# Altium schematic sheet Zigbee.SchDoc
size A4
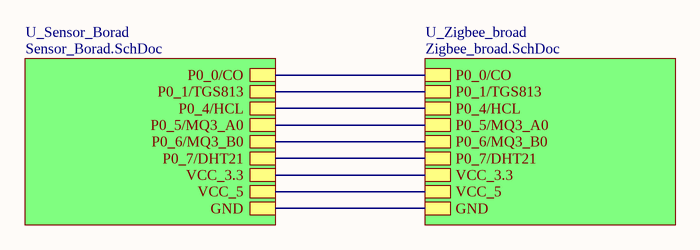
[diagram p0: Zigbee.SchDoc]

## Sub-sheets
U_Sensor_Borad = Sensor_Borad.SchDoc: P0_0/CO, P0_1/TGS813, P0_4/HCL, P0_5/MQ3_A0, P0_6/MQ3_B0, P0_7/DHT21, VCC_3.3, VCC_5, GND
U_Zigbee_broad = Zigbee_broad.SchDoc: P0_0/CO, P0_1/TGS813, P0_4/HCL, P0_5/MQ3_A0, P0_6/MQ3_B0, P0_7/DHT21, VCC_3.3, VCC_5, GND

## Nets
(unnamed): sheet U_Sensor_Borad/P0_0/CO, sheet U_Zigbee_broad/P0_0/CO
(unnamed): sheet U_Sensor_Borad/P0_1/TGS813, sheet U_Zigbee_broad/P0_1/TGS813
(unnamed): sheet U_Sensor_Borad/P0_4/HCL, sheet U_Zigbee_broad/P0_4/HCL
(unnamed): sheet U_Sensor_Borad/P0_5/MQ3_A0, sheet U_Zigbee_broad/P0_5/MQ3_A0
(unnamed): sheet U_Sensor_Borad/P0_6/MQ3_B0, sheet U_Zigbee_broad/P0_6/MQ3_B0
(unnamed): sheet U_Sensor_Borad/P0_7/DHT21, sheet U_Zigbee_broad/P0_7/DHT21
(unnamed): sheet U_Sensor_Borad/VCC_3.3, sheet U_Zigbee_broad/VCC_3.3
(unnamed): sheet U_Sensor_Borad/VCC_5, sheet U_Zigbee_broad/VCC_5
(unnamed): sheet U_Sensor_Borad/GND, sheet U_Zigbee_broad/GND